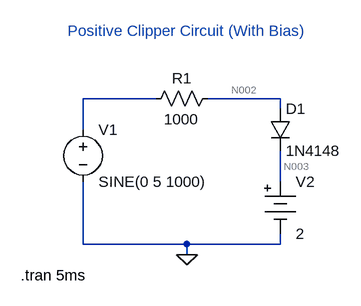
[diagram p0: schematic Assignment 1a (ii).asc]
Assignment 1a (ii).asc, the LTspice schematic file:
Version 4.1
SHEET 1 880 680
WIRE 192 80 80 80
WIRE 384 80 272 80
WIRE 384 96 384 80
WIRE 80 128 80 80
WIRE 384 208 384 160
WIRE 80 304 80 208
WIRE 240 304 80 304
WIRE 384 304 384 288
WIRE 384 304 240 304
WIRE 240 320 240 304
FLAG 240 320 0
SYMBOL voltage 80 112 R0
WINDOW 123 0 0 Left 0
WINDOW 39 0 0 Left 0
SYMATTR InstName V1
SYMATTR Value SINE(0 5 1000)
SYMBOL res 288 64 R90
WINDOW 0 0 56 VBottom 2
WINDOW 3 32 56 VTop 2
SYMATTR InstName R1
SYMATTR Value 1000
SYMBOL diode 368 96 R0
SYMATTR InstName D1
SYMATTR Value 1N4148
SYMBOL Misc\\battery 384 192 R0
WINDOW 123 0 0 Left 0
WINDOW 39 0 0 Left 0
SYMATTR InstName V2
SYMATTR Value 2
TEXT -16 352 Left 2 !.tran 5ms
TEXT 56 -24 Left 2 ;Positive Clipper Circuit (With Bias)

The netlist it stands for:
* Assignment 1a (ii).asc
V1 N001 0 SINE(0 5 1000)
R1 N002 N001 1000
D1 N002 N003 1N4148
V2 N003 0 2
.model D D
.lib standard.dio
.tran 5ms
* Positive Clipper Circuit (With Bias)
.backanno
.end

* Results of the author's LTspice run, read from the files saved beside the schematic
* Operating Point, zero values left out:
*   V(n002) = 2.522 µV
*   V(n003) = 2 V
*   I(V1) = 2.522 nA
*   I(D1) = -2.522 nA
*   I(R1) = 2.522 nA
*   I(V2) = -2.522 nA